# EAGLE design DS18B20Modular1 (EAGLE 7.3.0)
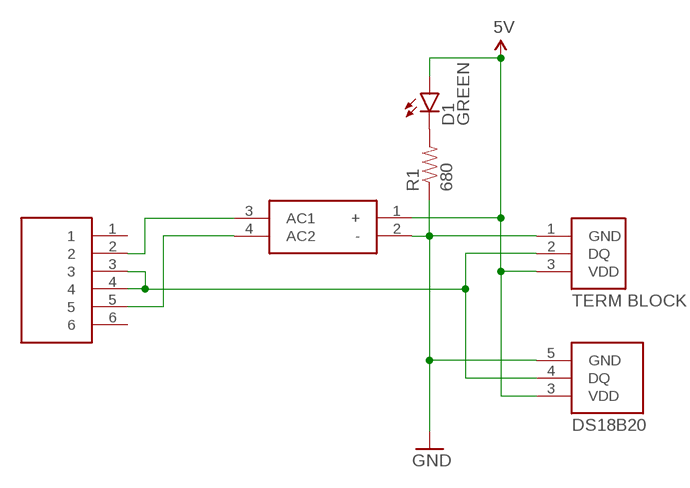
[diagram p0: schematic, sheet 1]

## Parts
D1  GREEN  LED-GREEN0603  [LED-0603]
J1  MODULAR-JACK-6P6C-1  [MODULAR-JACK-6P6C-1]
R1  680  RES-680-0805  [0805]
U$1  RECTIFIER-MB1S  [4-SOIC-FAIRCHILD]
U$2  TERMBLOCK-1WIRE  [TERMBLOCK-1WIRE]
U$3  DS18B208-SOIC  [DS18B20-S0]

## Nets
5V: D1.A U$1.1(+) U$2.3(VDD) U$3.3(VDD)
GND: R1.1 U$1.2(-) U$2.1(GND) U$3.5(GND)
N$1: J1.3 J1.4 U$2.2(DQ) U$3.4(DQ)
N$2: J1.2 U$1.3(AC1)
N$3: J1.5 U$1.4(AC2)
N$4: D1.C R1.2
Unconnected: J1.1 J1.6

## Notes on the sheet
- TERM BLOCK
- DS18B20

## Library data of the parts
D1 = rickk2:LED-GREEN: Lite-On LTST-C193KGKT-5A Green 572nm LED Indication - Discrete 2V 5 mA 0603 https://www.digikey.com/product-detail/en/lite-on-inc/LTST-C193KGKT-5A/160-1828-1-ND/2356247 Res = 270 ohm @ 3.3V, Res = 680 ohm 1/8W @ 5V
J1 = rickk2:MODULAR-JACK-6P6C-1: CONN MOD JACK 6P6C R/A UNSHLD $0.77 Stewart Connector SS-7066-NF Jack Modular Connector 6p6c (RJ11, RJ12, RJ14, RJ25) 90° Angle (Right) Unshielded Cat5 https://www.digikey.com/product-detail/en/stewart-connector/SS-7066-NF/380-1043-ND/388305
R1 = rickk2:RES-680-0805: RES SMD 680 OHM 5% 1/8W 0805 $0.10 Panasonic ERJ-6GEYJ681V ±5% 0.125W, 1/8W Chip Resistor 0805 (2012 Metric) Automotive AEC-Q200 Thick Film https://www.digikey.com/product-detail/en/panasonic-electronic-components/ERJ-6GEYJ681V/P680ACT-ND/90033
U$1 = rickk2:RECTIFIER-MB1S
U$2 = rickk2:TERMBLOCK-1WIRE: TERM BLOCK 3.5MM VERT 3POS PCB $1.00 3 Position Wire to Board Terminal Block Horizontal with Board 0.138" (3.50mm) Through Hole 10A 16-26 AWG Top screw, vertical, blue https://www.digikey.com/product-detail/en/on-shore-technology-inc/OSTTE030161/ED2636-ND/614585
U$3 = rickk2:DS18B20

## Board
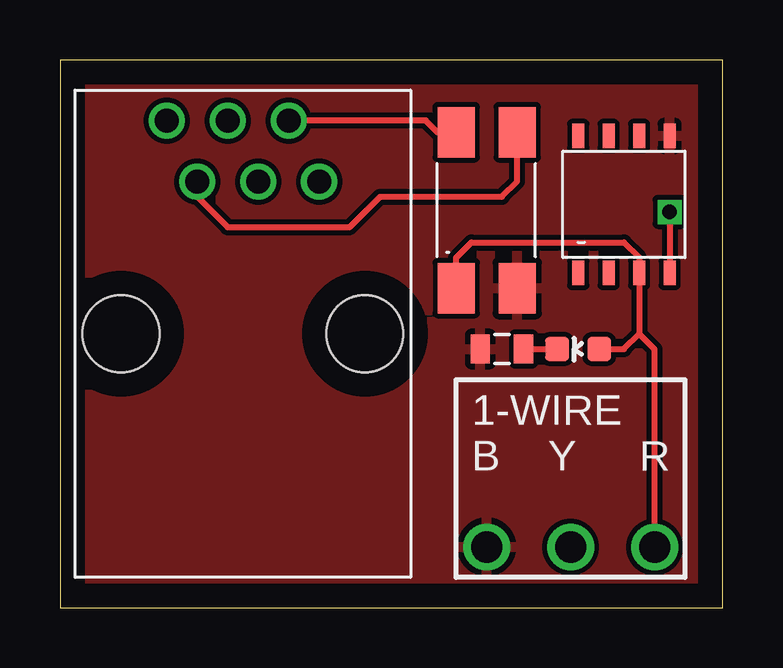
[diagram p1: board, top side]
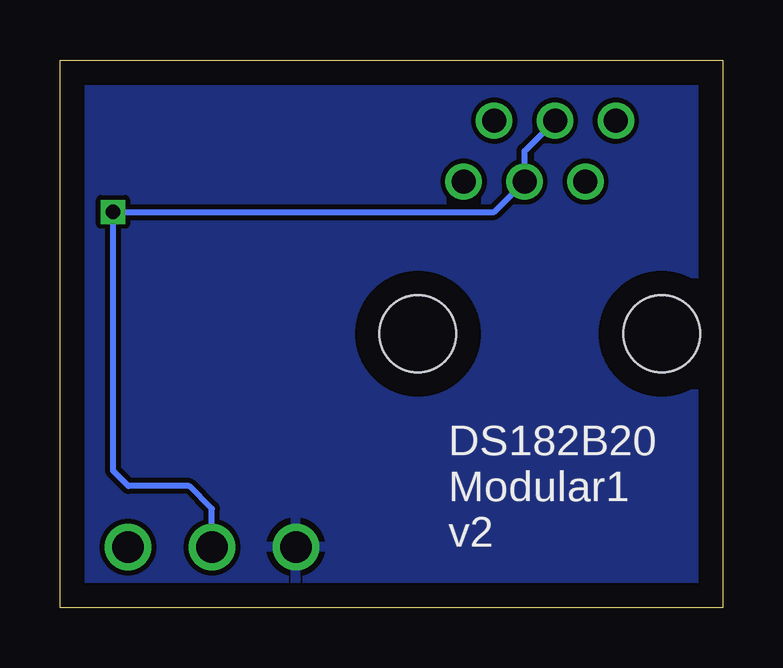
[diagram p2: board, bottom side, seen from below]

Size 27.61 x 22.85 mm. Coordinates in mm from the lower left corner, seen from the top.
Outline: 0,0 27.61,0 27.61,22.85 0,22.85 0,0
Copper layers (1*16): Top 0.035mm / dielectric 1.5mm / Bottom 0.035mm
Design rules "default": minimum track width 10mil, minimum drill 24mil, track to track 8mil, track to pad 8mil, pad to pad 8mil, via to via 8mil, smd to smd 8mil, copper to edge 40mil, drill to drill 8mil, minimum pad ring 10mil, minimum via ring 8mil, stop-mask expansion 4mil, vias tented up to drill 0mil, thermal gap 10mil

### Footprints (pad centres in the part's own frame; a part is rotated, then mirrored left to right if it is on the bottom)
LED-0603 = smd 1 x 1: A 0,-0.877; C 0,0.877
MODULAR-JACK-6P6C-1 = drill 1: 1 1.905,8.89; 2 3.175,6.35; 3 4.445,8.89; 4 5.715,6.35; 5 6.985,8.89; 6 8.255,6.35 | hole 3.2: 0,0; 10.16,0
0805 = smd 0.8 x 1.2: 1 -0.9,0; 2 0.9,0
4-SOIC-FAIRCHILD = smd 1.55 x 2.1: 1 0,0; 2 2.54,0; 3 2.54,6.5; 4 0,6.5
TERMBLOCK-1WIRE = drill 1.3: 1 0,0; 2 3.5,0; 3 7,0
DS18B20-S0 = smd 0.508 x 1.016: 1 0,0; 2 1.27,0; 3 2.54,0; 4 3.81,0; 5 3.81,5.715; 6 2.54,5.715; 7 1.27,5.715; 8 0,5.715

### Placement (x,y rotation side)
D1  21.59,10.79 90 top
J1  2.54,11.43 0 top
R1  18.41,10.79 0 top
U$1  16.51,13.34 0 top
U$2  17.78,2.54 0 top
U$3  21.59,13.97 0 top

### Tracks (layer width: path | path; a pad name or v marks a point on that pad's centre or on a via)
5V
  Top 0.254: 24.13,11.43 U$3.3 24.13,14.61 23.5,15.24 17.14,15.24 16.51,14.61 U$1.1 | 24.13,11.43 24.77,10.79 24.77,2.56 U$2.3 | D1.A 23.5,10.79 24.13,11.43
GND
  pour Bottom: 0,22.86 27.94,22.86 27.94,0 0,0
  pour Top: 0,22.86 27.94,22.86 27.94,0 0,0
N$1  (via drill 0.6)
  Top 0.254: v25.4,16.51 U$3.4
  Bottom 0.254: U$2.2 21.28,4.13 22.23,5.08 24.77,5.08 25.4,5.71 v25.4,16.51 9.53,16.51 J1.4 8.26,19.05 J1.3
N$2
  Top 0.254: J1.2 5.71,17.14 6.99,15.88 12.06,15.88 13.34,17.14 18.41,17.14 19.05,17.78 U$1.3
N$3
  Top 0.254: U$1.4 15.72,19.84 15.24,20.32 J1.5
N$4
  Top 0.254: R1.2 D1.C

### Text on the board
bPlace: DS182B20 / Modular1 / v2